# EAGLE design WiFi Turnout Controller v2 (EAGLE 7.7.0)
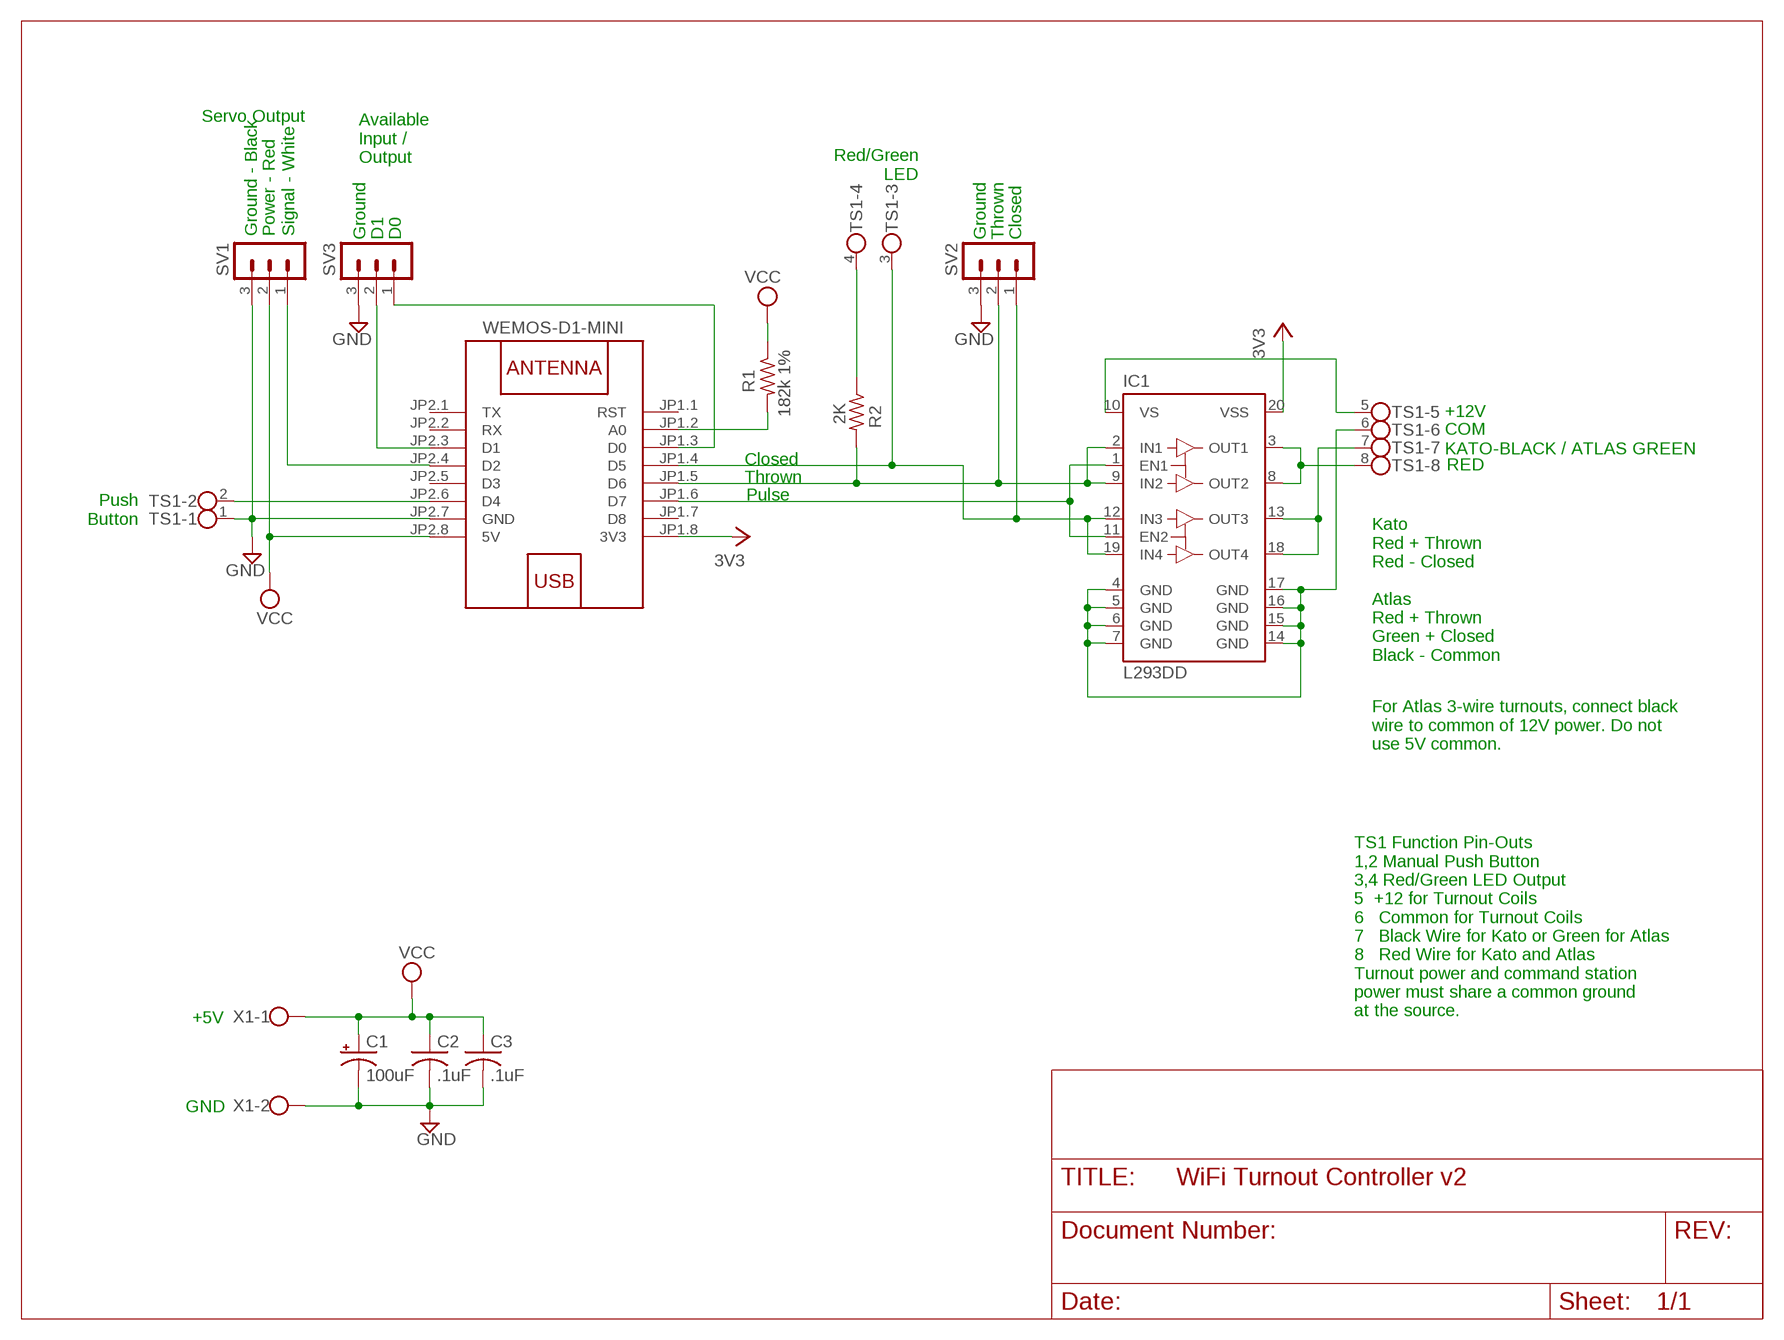
[diagram p0: schematic, sheet 1]

## Parts
C1  100uF  CPOL-USE3.5-8  [E3,5-8]
C2  .1uF  C-USC1206  [C1206]
C3  .1uF  C-USC1206  [C1206]
IC1  L293DD  [SO20]
R1  182k 1%  R-US_R1206  [R1206]
R2  2K  R-US_R1206  [R1206]
SV1  MA03-1  [MA03-1]
SV2  MA03-1  [MA03-1]
SV3  MA03-1  [MA03-1]
TS1  TERMBLK08  [08PB]
U$1  WEMOS-D1-MINI  [WEMOS-D1-MINI]
X1  W237-102  [W237-102]

## Nets
3V3: IC1.20(VSS) U$1.JP1.8(3V3)
COM: IC1.4(GND) IC1.5(GND) IC1.6(GND) IC1.7(GND) IC1.14(GND) IC1.15(GND) IC1.16(GND) IC1.17(GND) TS1.6
GND: C1.- C2.2 C3.2 SV1.3 SV2.3 SV3.3 TS1.1 U$1.JP2.7(GND) X1.2
N$1: R1.2 U$1.JP1.2(A0)
N$2: SV1.1 U$1.JP2.4(D2)
N$3: SV3.1 U$1.JP1.3(D0)
N$4: TS1.2 U$1.JP2.6(D4)
N$5: SV3.2 U$1.JP2.3(D1)
N$7: R2.1 TS1.4
N$9: IC1.12(IN3) IC1.19(IN4) SV2.1 TS1.3 U$1.JP1.4(D5)
N$11: IC1.2(IN1) IC1.9(IN2) R2.2 SV2.2 U$1.JP1.5(D6)
N$14: IC1.1(EN1) IC1.11(EN2) U$1.JP1.6(D7)
N$19: IC1.13(OUT3) IC1.18(OUT4) TS1.7
N$23: IC1.3(OUT1) IC1.8(OUT2) TS1.8
VCC: C1.+ C2.1 C3.1 R1.1 SV1.2 U$1.JP2.8(5V) X1.1
VS: IC1.10(VS) TS1.5
Unconnected: U$1.JP1.1(RST) U$1.JP1.7(D8) U$1.JP2.1(TX) U$1.JP2.2(RX) U$1.JP2.5(D3)

## Notes on the sheet
- Servo Output
- Red/Green
      LED
- Available
  Input /
  Output
- Ground - Black | Power - Red | Signal - White | Ground | D1 | D0 | Ground | Thrown | Closed
- +12V
- COM
- KATO-BLACK / ATLAS GREEN
- Closed
- RED
- Thrown
- Push
  Button
- Pulse
- Kato 
  Red + Thrown
  Red - Closed
  
  Atlas
  Red + Thrown
  Green + Closed
  Black - Common
- For Atlas 3-wire turnouts, connect black
  wire to common of 12V power. Do not
  use 5V common.
- +5V
- TS1 Function Pin-Outs
  1,2 Manual Push Button
  3,4 Red/Green LED Output
  5  +12 for Turnout Coils
  6   Common for Turnout Coils
  7   Black Wire for Kato or Green for Atlas
  8   Red Wire for Kato and Atlas
  Turnout power and command station
  power must share a common ground
  at the source.
- GND

## Library data of the parts
C1 = rcl:CPOL-US: POLARIZED CAPACITOR, American symbol
C2 C3 = rcl:C-US: CAPACITOR, American symbol
IC1 = st-microelectronics:L293DD: PUSH-PULL FOUR CHANNEL DRIVER WITH DIODES Source: http://www.st.com/stonline/books/pdf/docs/1330.pdf; OC_FARNELL: unknown
R1 R2 = rcl:R-US_: RESISTOR, American symbol
SV1-SV3 = con-lstb:MA03-1: PIN HEADER; OC_FARNELL: unknown; OC_NEWARK: unknown
TS1 = cdb:TERMBLK08
U$1 = diy-modules:WEMOS-D1-MINI: WEMOS D1 mini: Mini Wi-Fi Board based on ESP-8266 device More details can be found here: https://www.wemos.cc/product/d1-mini.html Click here to find device on ebay.com <http://www.ebay.com/sch/wemos+d1+mini+nodemcu>
X1 = con-wago-500:W237-102: WAGO SCREW CLAMP; MPN: 237-102; OC_FARNELL: unknown; OC_NEWARK: 70K9898

## Board
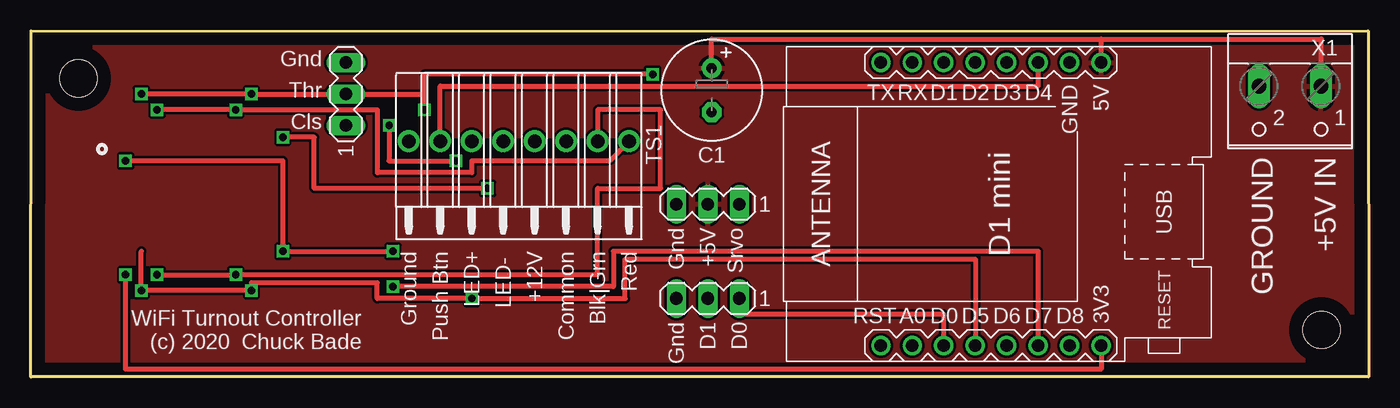
[diagram p1: board, top side]
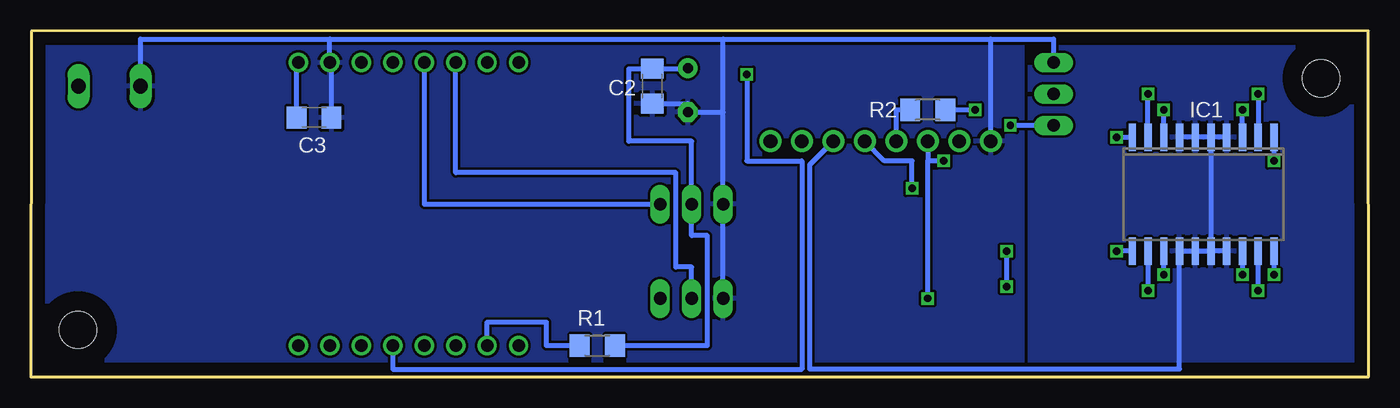
[diagram p2: board, bottom side, seen from below]

Size 107.95 x 27.95 mm. Coordinates in mm from the lower left corner, seen from the top.
Outline: 0.01,27.94 107.92,27.95 107.95,0 0,0 0.01,27.94
Copper layers (1*16): Top 0.035mm / dielectric 1.5mm / Bottom 0.035mm
Design rules "default *": minimum track width 10mil, minimum drill 10mil, track to track 8mil, track to pad 8mil, pad to pad 8mil, via to via 8mil, smd to smd 8mil, copper to edge 40mil, drill to drill 8mil, minimum pad ring 11mil, minimum via ring 8mil, stop-mask expansion 4mil, vias tented up to drill 0mil, thermal gap 10mil

### Footprints (pad centres in the part's own frame; a part is rotated, then mirrored left to right if it is on the bottom)
E3,5-8 = drill 0.813 pad 1.6: + -1.778,0 | drill 0.813 pad 1.6 octagon: - 1.778,0
C1206 = smd 1.6 x 1.8: 1 -1.4,0; 2 1.4,0
SO20 = smd 0.6 x 2.2: 1 -5.715,-4.6; 2 -4.445,-4.6; 3 -3.175,-4.6; 4 -1.905,-4.6; 5 -0.635,-4.6; 6 0.635,-4.6; 7 1.905,-4.6; 8 3.175,-4.6; 9 4.445,-4.6; 10 5.715,-4.6; 11 5.715,4.6; 12 4.445,4.6; 13 3.175,4.6; 14 1.905,4.6; 15 0.635,4.6; 16 -0.635,4.6; 17 -1.905,4.6; 18 -3.175,4.6; 19 -4.445,4.6; 20 -5.715,4.6
R1206 = smd 1.6 x 1.803: 1 -1.422,0; 2 1.422,0
MA03-1 = drill 1.016 long: 1 -2.54,0; 2 0,0; 3 2.54,0
08PB = drill 1.1 pad 1.778: 1 8.89,0; 2 6.35,0; 3 3.81,0; 4 1.27,0; 5 -1.27,0; 6 -3.81,0; 7 -6.35,0; 8 -8.89,0
WEMOS-D1-MINI = drill 1: JP1.1 -11.43,9.525; JP1.2 -11.43,6.985; JP1.3 -11.43,4.445; JP1.4 -11.43,1.905; JP1.5 -11.43,-0.635; JP1.6 -11.43,-3.175; JP1.7 -11.43,-5.715; JP1.8 -11.43,-8.255; JP2.1 11.43,9.525; JP2.2 11.43,6.985; JP2.3 11.43,4.445; JP2.4 11.43,1.905; JP2.5 11.43,-0.635; JP2.6 11.43,-3.175; JP2.7 11.43,-5.715; JP2.8 11.43,-8.255
4-40SCREW = hole 2.997: 0,0
W237-102 = drill 1.194 long: 1 -2.5,-1.27; 2 2.5,-1.27

### Placement (x,y rotation side)
C1  54.94,23.17 270 top
C2  57.8,23.49 270 bottom
C3  85.1,20.95 0 bottom
IC1  13.35,14.77 180 bottom
R1  62.24,2.54 180 bottom
R2  35.57,21.59 0 bottom
SV1  54.62,13.97 180 top
SV2  25.41,22.86 90 top
SV3  54.62,6.35 180 top
TS1  39.38,19.05 180 top
U$1  78.12,13.97 90 top
U$3  [4-40SCREW]  3.82,24.13 180 bottom
U$4  [4-40SCREW]  104.15,3.81 180 bottom
X1  101.61,22.22 180 top

### Tracks (layer width: path | path; a pad name or v marks a point on that pad's centre or on a via)
3V3  (via drill 0.6)
  Top 0.406: U$1.JP1.8 86.37,0.63 7.63,0.63 v7.63,8.25
  Bottom 0.406: IC1.20 v7.63,8.25
COM
  Bottom 0.406: IC1.5 IC1.16 | IC1.17 IC1.16 | IC1.16 IC1.15 IC1.14 15.25,0.63 45.1,0.63 45.1,17.14 TS1.6 | IC1.4 IC1.5 | IC1.7 IC1.6 IC1.5
  pour Bottom: 27.32,-0.64 -0.62,-0.64 -0.62,28.57 27.32,28.57
GND
  Bottom 0.406: TS1.1 30.49,27.3 | SV2.3 25.41,27.3 30.49,27.3 | 83.83,27.3 U$1.JP2.7 83.7,25.4 C3.2 | 83.83,27.3 52.08,27.3 | 52.08,27.3 30.49,27.3 | X1.2 99.11,27.3 83.83,27.3 | 52.08,21.39 C1.- 54.94,22.09 C2.2 | 52.08,21.39 52.08,27.3 | 52.08,21.39 SV1.3 SV3.3
  pour Bottom: 109.23,-0.64 27.95,-0.64 27.95,28.57 109.23,28.57
N$1
  Bottom 0.406: U$1.JP1.2 71.13,4.44 66.37,4.44 66.37,2.54 R1.2
N$2
  Bottom 0.406: U$1.JP2.4 76.21,13.97 SV1.1
N$3
  Top 0.406: U$1.JP1.3 73.67,5.08 57.16,5.08 SV3.1
N$4
  Top 0.406: TS1.2 33.03,23.49 81.29,23.49 U$1.JP2.6
N$5
  Bottom 0.406: SV3.2 54.62,8.89 55.89,8.89 55.89,16.51 73.67,16.51 U$1.JP2.3
N$7
  Bottom 0.406: TS1.4 38.11,21.59 R2.1
N$9  (via drill 0.6)
  Top 0.406: IC1.19 v8.9,6.98 v17.79,6.98 17.79,7.62 27.95,7.62 27.95,6.35 v35.57,6.35 47.95,6.35 47.95,9.52 76.21,9.52 U$1.JP1.4 | v28.9,20.32 28.9,17.46 v34.3,17.46
  Bottom 0.406: v8.9,6.98 IC1.19 | IC1.12 v17.79,6.98 | TS1.3 35.57,17.46 | SV2.1 v28.9,20.32 | v34.3,17.46 35.57,17.46 | v35.57,6.35 35.57,17.46
N$11  (via drill 0.6)
  Top 0.406: v8.9,22.86 v17.79,22.86 SV2.2 31.76,22.86 | 31.76,22.86 v31.76,21.59 | v50.18,24.44 31.76,24.44 31.76,22.86
  Bottom 0.406: v8.9,22.86 IC1.2 | IC1.9 v17.79,22.86 | R2.2 v31.76,21.59 | U$1.JP1.5 78.75,0.63 45.73,0.63 45.73,17.46 50.18,17.46 v50.18,24.44
N$14  (via drill 0.6)
  Top 0.406: v7.63,17.46 20.33,17.46 v20.33,10.16 v29.22,10.16 | U$1.JP1.6 81.29,10.16 47,10.16 47,7.3 v29.22,7.3
  Bottom 0.406: IC1.1 v7.63,17.46 | IC1.11 v20.33,10.17 v20.33,10.16 | v29.22,10.16 v29.22,7.3
N$19  (via drill 0.6)
  Top 0.406: v10.17,8.25 v16.52,8.25 45.73,8.25 45.73,15.24 50.81,15.24 50.81,21.59 45.73,21.59 TS1.7
  Bottom 0.406: IC1.18 v10.17,8.25 | v16.52,8.25 IC1.13
N$23  (via drill 0.6)
  Top 0.406: v10.17,21.59 v16.52,21.59 27.95,21.59 27.95,16.51 35.57,16.51 35.57,17.46 46.68,17.46 TS1.8
  Bottom 0.406: IC1.8 v16.52,21.59 | IC1.3 v10.17,21.59
VCC
  Top 0.406: U$1.JP2.8 86.37,27.3 | 86.37,27.3 104.11,27.3 | C1.+ 54.94,27.3 86.37,27.3 | 104.15,27.3 104.11,27.3 | 104.11,27.3 X1.1
  Bottom 0.406: C1.+ 54.94,24.89 C2.1 59.7,24.89 59.7,19.05 54.62,19.05 SV1.2 54.62,11.43 53.35,11.43 53.35,2.54 R1.1 | C3.1 86.5,25.4 U$1.JP2.8
  pour Top: -1.58,-1.27 109.87,-1.27 109.87,29.21 -1.58,29.21
VS  (via drill 0.6)
  Top 0.406: v36.84,15.24 22.87,15.24 22.87,19.36 v20.33,19.36
  Bottom 0.406: v20.33,19.36 20.01,19.37 IC1.10 | v36.84,15.24 36.84,17.46 39.06,17.46 TS1.5

### Text on the board
tPlace: WiFi Turnout Controller / (c) 2020 Chuck Bade
tNames: Gnd | Thr | Cls | GROUND | +5V IN | Gnd | +5V | Srvo | Ground | Push Btn | LED+ | LED- | +12V | Common | Blk|Grn | Red | Gnd | D1 | D0